# EAGLE design rogerbeep (EAGLE 7.7.0)
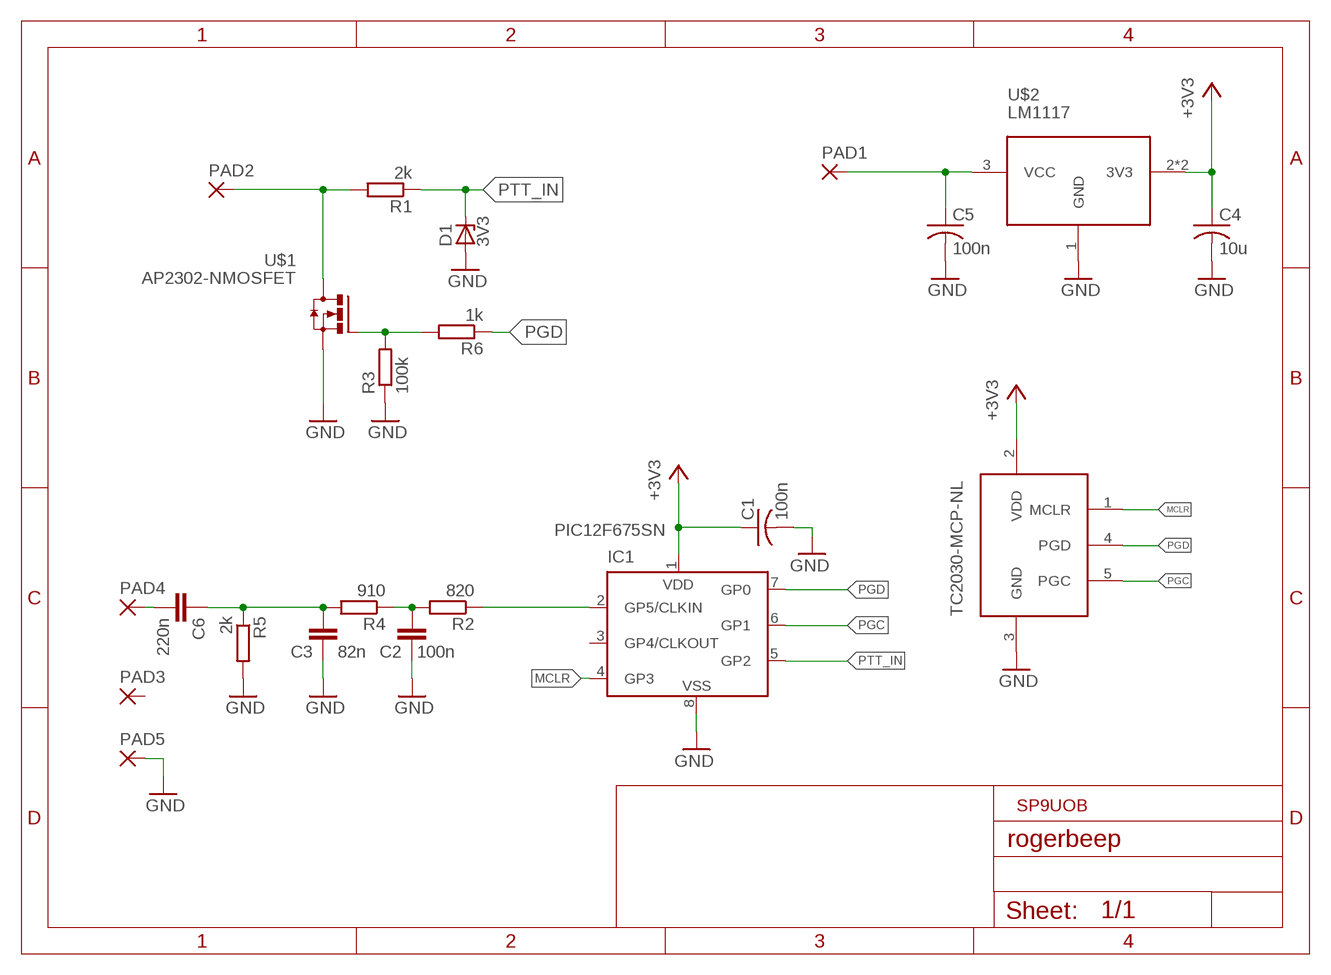
[diagram p0: schematic, sheet 1]

## Parts
C1  100n  C-USC0805  [C0805]
C2  100n  C-EUC0603  [C0603]
C3  82n  C-EUC0603  [C0603]
C4  10u  C-USC0805  [C0805]
C5  100n  C-USC0805  [C0805]
C6  220n  C-EUC0603  [C0603]
D1  3V3  ZENER-DIODESOT23  [SOT23]
IC1  PIC12F675SN  [SO-08]
PAD1  SMD5  [SMD2,54-5,08]
PAD2  SMD5  [SMD2,54-5,08]
PAD3  SMD5  [SMD2,54-5,08]
PAD4  SMD2  [SMD1,27-2,54]
PAD5  SMD2  [SMD1,27-2,54]
R1  2k  R-EU_R0603  [R0603]
R2  820  R-EU_R0603  [R0603]
R3  100k  R-EU_R0603  [R0603]
R4  910  R-EU_R0603  [R0603]
R5  2k  R-EU_R0603  [R0603]
R6  1k  R-EU_R0603  [R0603]
U$1  AP2302-NMOSFET  [SOT23-3]
U$2  LM1117  [SOT223-3]
U$5  TC2030-MCP  [TC2030-IDC-NL]

## Nets
13.8V: C5.1 PAD1.1(P) U$2.3(VCC)
+3V3: C1.1 C4.1 IC1.1(VDD) U$2.2(3V3) U$2.4(3V3) U$5.2(VDD)
GND: C1.2 C2.1 C3.1 C4.2 C5.2 D1.1(A) IC1.8(VSS) PAD5.1(P) R3.1 R5.2 U$1.2(S1) U$2.1(GND) U$5.3(GND)
MCLR: IC1.4(GP3) U$5.1(MCLR)
MOD: C3.2 C6.1 R4.2 R5.1
N$1: IC1.2(GP5/CLKIN) R2.1
N$2: PAD2.1(P) R1.2 U$1.3(D1)
N$3: C2.2 R2.2 R4.1
N$4: C6.2 PAD4.1(P)
N$11: R3.2 R6.2 U$1.1(G1)
PGC: IC1.6(GP1) U$5.5(PGC)
PGD: IC1.7(GP0) R6.1 U$5.4(PGD)
PTT_IN: D1.3(C) IC1.5(GP2) R1.1
Unconnected: IC1.3(GP4/CLKOUT) PAD3.1(P)

## Notes on the sheet
- SP9UOB

## Library data of the parts
C1 C4 C5 = rcl:C-US: CAPACITOR, American symbol
C2 C3 C6 = rcl:C-EU: CAPACITOR, European symbol
D1 = diode:ZENER-DIODE: Z-Diode
IC1 = microchip:PIC12F6*: Data Sheet 8-Pin FLASH-Based 8-Bit CMOS Microcontrollers Source: http://www.microchip.com .. 41190c.pdf; MF: MICROCHIP; MPN: PIC12F675-E/SN; OC_FARNELL: 9759026; OC_NEWARK: 92C4341
PAD1-PAD3 = wirepad:SMD5: SMD PAD
PAD4 PAD5 = wirepad:SMD2: SMD PAD
R1-R6 = rcl:R-EU_: RESISTOR, European symbol
U$1 = vx:AP2302-NMOSFET
U$2 = vx:LM1117
U$5 = connector:TC2030-MCP

## Board
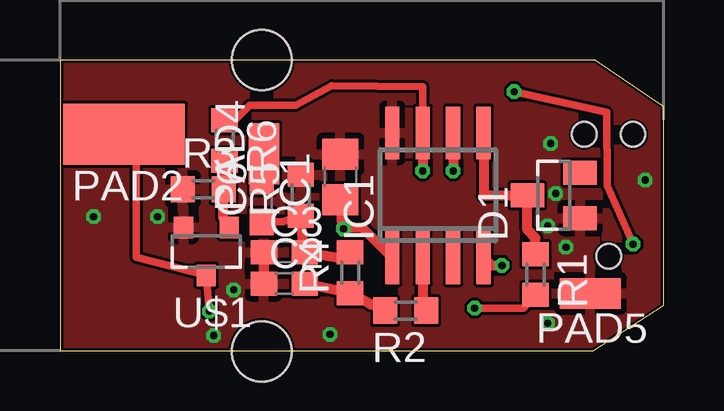
[diagram p1: board, top side]
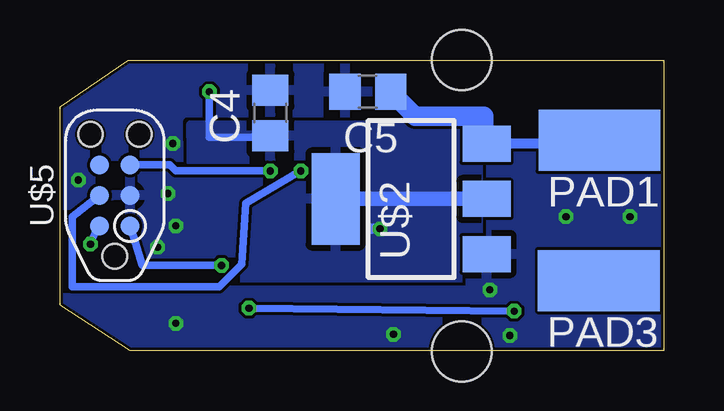
[diagram p2: board, bottom side, seen from below]

Size 25.15 x 12.12 mm. Coordinates in mm from the lower left corner, seen from the top.
Outline: 0,0 22.23,0 25.15,1.91 25.15,10.16 22.3,12.12 0,12.12 0,0
Copper layers (1*16): Top 0.035mm / dielectric 1.5mm / Bottom 0.035mm
Design rules "jlcpcb": minimum track width 5mil, minimum drill 0.25mm, track to track 5mil, track to pad 5mil, pad to pad 5mil, via to via 5mil, smd to smd 0mil, copper to edge 5mil, drill to drill 6mil, minimum pad ring 10mil, minimum via ring 6mil, stop-mask expansion 2mil, vias tented up to drill 100mil, thermal gap 10mil
Holes 2.5 mm at 8.41,12.12 8.41,-0.03

### Footprints (pad centres in the part's own frame; a part is rotated, then mirrored left to right if it is on the bottom)
C0805 = smd 1.3 x 1.5: 1 -0.95,0; 2 0.95,0
C0603 = smd 1.1 x 1: 1 -0.85,0; 2 0.85,0
SOT23 = smd 1 x 1.4: 1 -0.95,-1.1; 2 0.95,-1.1; 3 0,1.1
SO-08 = smd 0.6 x 2.2: 1 -1.905,-2.6; 2 -0.635,-2.6; 3 0.635,-2.6; 4 1.905,-2.6; 5 1.905,2.6; 6 0.635,2.6; 7 -0.635,2.6; 8 -1.905,2.6
SMD2,54-5,08 = smd 2.54 x 5.08: 1 0,0
SMD1,27-2,54 = smd 1.27 x 2.54: 1 0,0
R0603 = smd 1 x 1.1: 1 -0.85,0; 2 0.85,0
SOT23-3 = smd 0.8 x 0.9: 1 -0.95,-1; 2 0.95,-1; 3 0,1
SOT223-3 = smd 1.5 x 2: 1 -2.3,-3.15; 2 0,-3.15; 3 2.3,-3.15 | smd 3.8 x 2: 4 0,3.15
TC2030-IDC-NL = smd 0.787 x 0.787: 1 -1.27,-0.635; 2 -1.27,0.635; 3 0,-0.635; 4 0,0.635; 5 1.27,-0.635; 6 1.27,0.635 | hole 1.016: -2.54,0; 2.54,1.016; 2.54,-1.016

### Placement (x,y rotation side)
C1  11.68,7.24 90 top
C2  9.35,2.79 0 top
C3  9.35,4.11 0 top
C4  16.38,9.91 90 bottom
C5  12.32,10.8 180 bottom
C6  8.41,6.22 90 top
D1  20.57,6.48 90 top
IC1  15.75,6.48 0 top
PAD1  2.67,8.76 90 bottom
PAD2  2.67,9.02 90 top
PAD3  2.69,2.92 90 bottom
PAD4  8.51,8.2 0 top
PAD5  22.1,2.39 90 top
R1  19.81,3.18 270 top
R2  14.4,1.68 180 top
R3  5.97,6.73 0 top
R4  12.09,3.25 90 top
R5  10.03,6.48 90 top
R6  6.86,8.76 270 top
U$1  6.1,4.14 180 top
U$2  10.52,6.32 90 bottom
U$5  22.86,6.48 90 bottom

### Tracks (layer width: path | path; a pad name or v marks a point on that pad's centre or on a via)
13.8V
  Bottom 0.406: 3.94,8.64 4.32,8.64 7.49,8.64 7.33,8.59
  Bottom 0.813: PAD1.1 3.94,8.64 | C5.1 10.35,9.78 7.49,9.78 7.49,8.4 U$2.3 7.33,8.59
+3V3  (via drill 0.3)
  Top 0.305: v23.88,4.45 22.81,6.88 22.78,9.93 v18.92,10.8 | v11.81,5.08 11.73,5.08 11.73,5.21
  Top 0.406: C1.1 11.73,5.21 11.74,5.15 12.57,5.15 IC1.1
  Bottom 0.305: U$5.2 23.62,5.08 v23.88,4.45 | v18.92,10.8 18.92,8.89 16.45,8.89 C4.1
  Bottom 0.406: v11.81,5.08 12.19,5.08
  Bottom 0.61: U$2.2 U$2.4
  pour Bottom (isolate 0.127): 7.75,9.4 7.75,3.05 19.56,3.05 19.68,9.4
GND  (via drill 0.3)
  Top 0.406: C3.1 C2.1
  other vias: 21.08,4.32 20.32,5.21 20.65,6.55 1.4,5.59 20.32,1.14 24.38,7.11 20.45,8.64 7.24,2.54 4.06,5.59 6.4,0.64 11.25,0.69
  pour Top: -18.54,22.99 29.72,22.99 29.72,-8.76 -18.54,-8.76
  pour Bottom (rank 6): -9.4,16.64 -9.4,-5.71 36.7,-5.71 36.7,16.64
MCLR  (via drill 0.3)
  Top 0.406: IC1.4 17.97,3.56 v18.41,3.56
  Bottom 0.305: v18.41,3.56 21.72,3.56 U$5.1
MOD
  Top 0.305: R5.1 9.27,5.37 C6.1
  Top 0.406: R4.2 12.03,3.81 C3.2 arc-90 10.25,4.19 10.16,4.19 R5.1
N$1
  Top 0.406: IC1.2 15.11,1.61 R2.1
N$2  (via drill 0.3)
  Top 0.305: R1.2 19.3,1.78 v17.27,1.78 | v6.22,1.65 U$1.3 3.17,3.9 3.17,9.14 PAD2.1
  Bottom 0.305: v17.27,1.78 v6.22,1.65
N$3
  Top 0.406: R2.2 12.94,1.93 R4.1 C2.2
N$4
  Top 0.305: C6.2 8.41,7.85 PAD4.1
N$11
  Top 0.406: U$1.1 6.79,5.56 R3.2 6.86,6.73 R6.2
PGC  (via drill 0.3)
  Top 0.406: IC1.6 v16.38,7.49
  Bottom 0.305: v16.38,7.49 20.32,7.49 20.57,7.75 U$5.5
PGD  (via drill 0.3)
  Top 0.305: IC1.7 15.11,11 11.33,11.05 9.83,10.22 7.91,10.22 7.29,9.6 R6.1
  Top 0.406: IC1.7 v15.11,7.49
  Bottom 0.305: U$5.4 24.64,5.59 24.64,2.67 18.52,2.67 17.58,3.61 17.4,6.15 v15.11,7.49
PTT_IN
  Top 0.406: IC1.5 17.65,6.48 D1.3 19.47,5.04 19.81,4.7 R1.1